# Altium project Fri3d_2024_CVR_00.PrjPcb
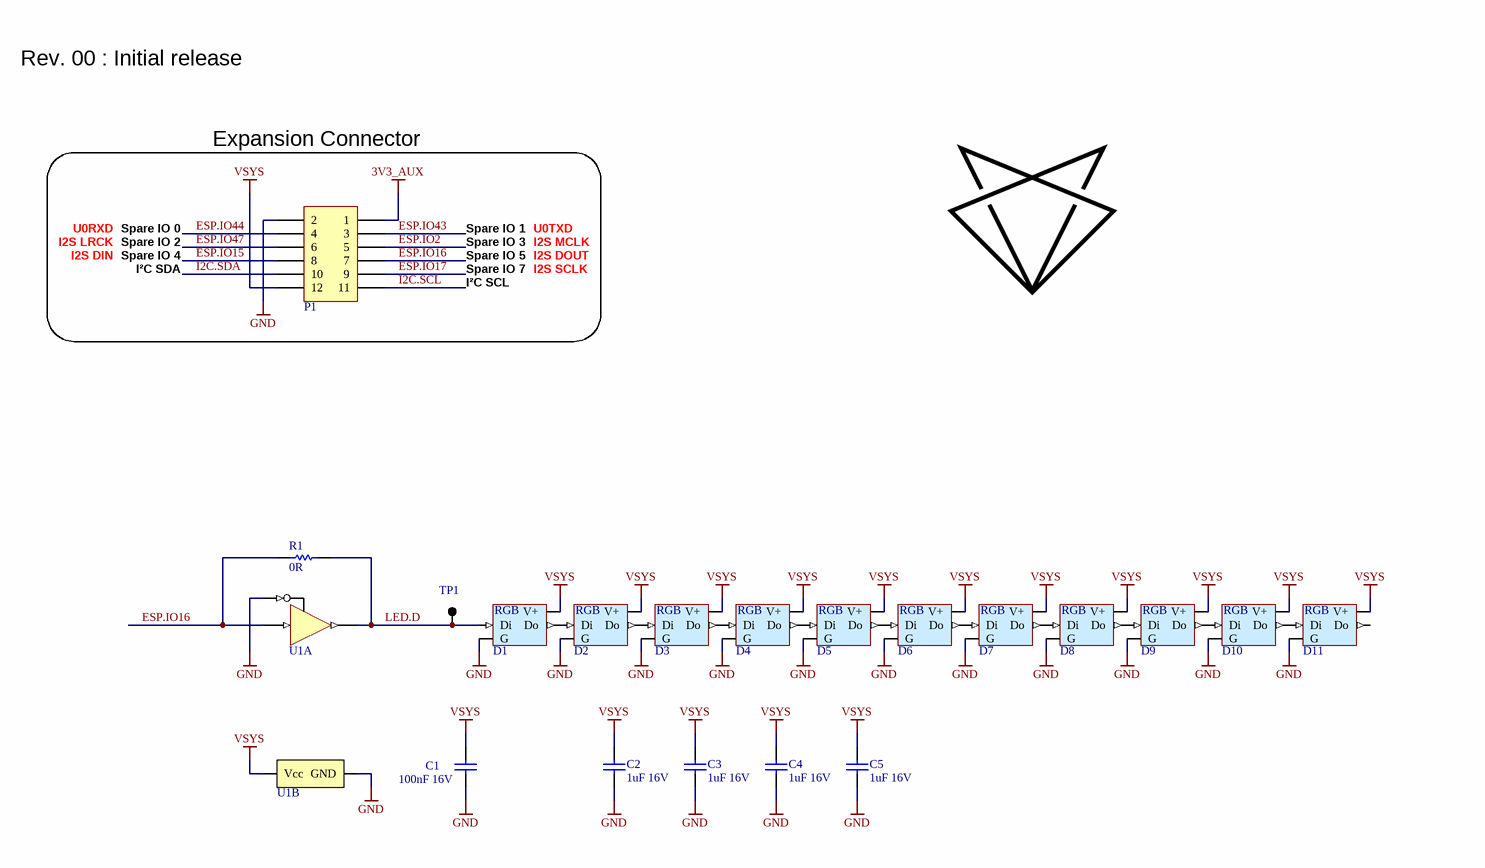
[diagram p0: Fri3d_2024_CVR_00.SchDoc]
PCB_ENGINEER: WimVG; PCB_REV: 00; PCB_TITLE: Fri3D Badge 2024 CVR
1 sheet, 20 parts. Net scope: global (net labels, ports and power ports of the same name join across sheets).
Board file: Fri3d_2024_CVR_00.PcbDoc

## Sheet Fri3d_2024_CVR_00.SchDoc: Exp0
size A3; Date: 22/06/2023; DrawnBy: Wim Van Gool; DocumentNumber: 1; Revision: 00; SheetNumber: 1; SheetTotal: 4

### Parts
C1  value 100nF 16V  [C0603_N]
C2  value 1uF 16V  [C0603_N]  (hidden comment: CAP_CERAMIC)
C3  value 1uF 16V  [C0603_N]  (hidden comment: CAP_CERAMIC)
C4  value 1uF 16V  [C0603_N]  (hidden comment: CAP_CERAMIC)
C5  value 1uF 16V  [C0603_N]  (hidden comment: CAP_CERAMIC)
D1  WS2812 based digital RGB LED 4020 White package Side emitting  [LED_4020_WS2812B_WHITE]  (value not drawn)
D2  WS2812 based digital RGB LED 4020 White package Side emitting  [LED_4020_WS2812B_WHITE]  (value not drawn)
D3  WS2812 based digital RGB LED 4020 White package Side emitting  [LED_4020_WS2812B_WHITE]  (value not drawn)
D4  WS2812 based digital RGB LED 4020 White package Side emitting  [LED_4020_WS2812B_WHITE]  (value not drawn)
D5  WS2812 based digital RGB LED 4020 White package Side emitting  [LED_4020_WS2812B_WHITE]  (value not drawn)
D6  WS2812 based digital RGB LED 4020 White package Side emitting  [LED_4020_WS2812B_WHITE]  (value not drawn)
D7  WS2812 based digital RGB LED 4020 White package Side emitting  [LED_4020_WS2812B_WHITE]  (value not drawn)
D8  WS2812 based digital RGB LED 4020 White package Side emitting  [LED_4020_WS2812B_WHITE]  (value not drawn)
D9  WS2812 based digital RGB LED 4020 White package Side emitting  [LED_4020_WS2812B_WHITE]  (value not drawn)
D10  WS2812 based digital RGB LED 4020 White package Side emitting  [LED_4020_WS2812B_WHITE]  (value not drawn)
D11  WS2812 based digital RGB LED 4020 White package Side emitting  [LED_4020_WS2812B_WHITE]  (value not drawn)
P1  Header 6X2  [HDR2X6]  (value not drawn)
R1  value 0R  [R0402]  (hidden comment: RESISTOR)
TP1  TEST_PAD  [TP_2x3mm]  (value not drawn)
U1  SN74AHCT1G125DCKR  Buffer, Tri-State, 4.5V to 5.5V  [TI_DCK_R-PDSO-G5]  (value not drawn)  (parts A,B of 2)

### Blocks framed on the sheet
Expansion Connector: P1

### Nets
3V3_AUX: P1.1
GND: C1.2 C2.2 C3.2 C4.2 C5.2 D1.4(G) D2.4(G) D3.4(G) D4.4(G) D5.4(G) D6.4(G) D7.4(G) D8.4(G) D9.4(G) D10.4(G) D11.4(G) P1.2 U1.1(~{OE}) U1.3(GND)
VSYS: C1.1 C2.1 C3.1 C4.1 C5.1 D1.2(V+) D2.2(V+) D3.2(V+) D4.2(V+) D5.2(V+) D6.2(V+) D7.2(V+) D8.2(V+) D9.2(V+) D10.2(V+) D11.2(V+) P1.12 U1.5(Vcc)
ESP.IO2: P1.5
ESP.IO15: P1.8
ESP.IO16: P1.7 R1.2 U1.2(A)
ESP.IO17: P1.9
ESP.IO43: P1.3
ESP.IO44: P1.4
ESP.IO47: P1.6
I2C.SCL: P1.11
I2C.SDA: P1.10
LED.D: D1.1(Di) R1.1 TP1.1 U1.4(Y)
NetD1_3: D1.3(Do) D2.1(Di)
NetD2_3: D2.3(Do) D3.1(Di)
NetD3_3: D3.3(Do) D4.1(Di)
NetD4_3: D4.3(Do) D5.1(Di)
NetD5_3: D5.3(Do) D6.1(Di)
NetD6_3: D6.3(Do) D7.1(Di)
NetD7_3: D7.3(Do) D8.1(Di)
NetD8_3: D8.3(Do) D9.1(Di)
NetD9_3: D9.3(Do) D10.1(Di)
NetD10_3: D10.3(Do) D11.1(Di)

Not connected (* = marked no-connect by the designer): D11 3(Do)

### Notes on the sheet
- Rev. 00 : Initial release
- I2S LRCK
- I2S DIN
- U0RXD
- Spare IO 0
- Spare IO 2
- Spare IO 4
- Spare IO 1
- Spare IO 3
- Spare IO 5
- I2S MCLK
- I2S DOUT
- U0TXD
- I²C SDA
- I²C SCL
- Spare IO 7
- I2S SCLK
- Title
- Revision
- Date
- Dranw By
- Size
- A3
- Sheet
- of
- (in symbol LED # RGB WS2812B-4020 WH RA) RGB

### Library data of the parts
C1 = CAP # 100nF 16V 0603: Capacitor Ceramic
C2-C5 = CAP # 1uF 16V 0603: Capacitor Ceramic; Supplier 1: Farnell; Supplier Part Number 1: 2320814
D1-D11 = LED # RGB WS2812B-4020 WH RA: =Description; Value: WS218B 4020 WH RA; Supplier 1: LCSC; Supplier Part Number 1: C965557
P1 = Pin Header 2.54mm dual row 12way
R1 = RES # 0R 0402: Description: RES # 0R 0402; Supplier 1: Farnell; Supplier Part Number 1: 2072513; Supplier 3: Generic; Supplier Part Number 3: 0R 1% 0402
TP1 = TP # 2x3mm: Value: NO BOM; Supplier 1: XXX; Supplier Part Number 1: FOOTPRINT ONLY
U1 = BUF # 1 SN74AHCT1G125DCKR: =Description; Value: SN74AHCT1G125DCKR; Supplier 1: LCSC; Supplier Part Number 1: C151417; Supplier 2: LCSC; Supplier Part Number 2: C350557

## Assembly variants
Default: not fitted C1 C3 D6 D14 J1 MOD2 P4 P5 P6 P8 P9 R3 R4 R18 R19 R28 R31 R32 R34 R44 R47 T4 U2 U3